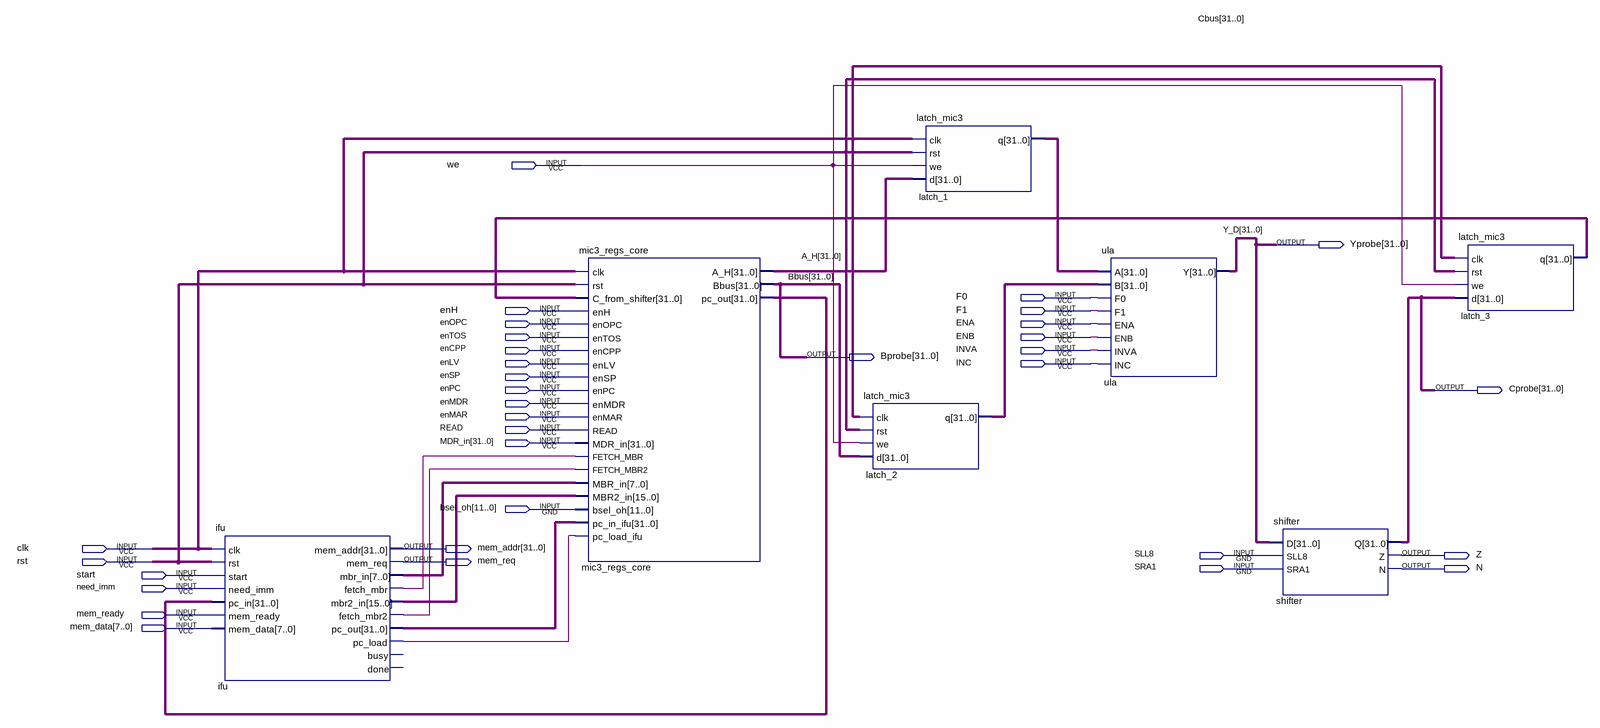
[diagram p0: schematic sheet]
// Quartus schematic mic3_draw.bdf as structural Verilog: 7 symbols, 34 pins
module mic3_draw (
  input  we,
  input  F0,
  input  enH,
  input  F1,
  input  enOPC,
  input  ENA,
  input  enTOS,
  input  ENB,
  input  enCPP,
  input  INVA,
  input  enLV,
  input  INC,
  input  enSP,
  input  enPC,
  input  enMDR,
  input  enMAR,
  input  READ,
  input  [31:0] MDR_in,
  input  [11:0] bsel_oh,
  input  clk,
  input  SLL8,
  input  rst,
  input  SRA1,
  input  start,
  input  need_imm,
  input  mem_ready,
  input  [7:0] mem_data,
  output [31:0] Yprobe,
  output [31:0] Bprobe,
  output [31:0] Cprobe,
  output [31:0] mem_addr,
  output Z,
  output mem_req,
  output N
);

  wire ifu_fetch_mbr, ifu_fetch_mbr2, ifu_pc_load;
  wire [7:0] ifu_mbr_in;
  wire [15:0] ifu_mbr2_in;
  wire [31:0] A_H, Cbus, ifu_pc_out, latch_1_q, latch_2_q, mic3_regs_core_pc_out;

  ifu ifu (
    .clk(clk), .rst(rst), .start(start), .need_imm(need_imm), .pc_in(mic3_regs_core_pc_out),
    .mem_ready(mem_ready), .mem_data(mem_data), .mem_addr(mem_addr), .mem_req(mem_req), .mbr_in(ifu_mbr_in),
    .fetch_mbr(ifu_fetch_mbr), .mbr2_in(ifu_mbr2_in), .fetch_mbr2(ifu_fetch_mbr2), .pc_out(ifu_pc_out),
    .pc_load(ifu_pc_load));  // open: busy, done
  mic3_regs_core mic3_regs_core (
    .clk(clk), .rst(rst), .C_from_shifter(Cbus), .enH(enH), .enOPC(enOPC), .enTOS(enTOS), .enCPP(enCPP),
    .enLV(enLV), .enSP(enSP), .enPC(enPC), .enMDR(enMDR), .enMAR(enMAR), .READ(READ), .MDR_in(MDR_in),
    .FETCH_MBR(ifu_fetch_mbr), .FETCH_MBR2(ifu_fetch_mbr2), .MBR_in(ifu_mbr_in), .MBR2_in(ifu_mbr2_in),
    .bsel_oh(bsel_oh), .pc_in_ifu(ifu_pc_out), .pc_load_ifu(ifu_pc_load), .A_H(A_H), .Bbus(Bprobe),
    .pc_out(mic3_regs_core_pc_out));
  latch_mic3 latch_2 (.clk(clk), .rst(rst), .we(we), .d(Bprobe), .q(latch_2_q));
  latch_mic3 latch_1 (.clk(clk), .rst(rst), .we(we), .d(A_H), .q(latch_1_q));
  ula ula (.A(latch_1_q), .B(latch_2_q), .F0(F0), .F1(F1), .ENA(ENA), .ENB(ENB), .INVA(INVA), .INC(INC), .Y(Yprobe));
  shifter shifter (.D(Yprobe), .SLL8(SLL8), .SRA1(SRA1), .Q(Cprobe), .Z(Z), .N(N));
  latch_mic3 latch_3 (.clk(clk), .rst(rst), .we(we), .d(Cprobe), .q(Cbus));

  // Other names for the same wires on the sheet: Bbus[31:0] = Bprobe; Y_D[31:0] = Yprobe
endmodule
